# Altium schematic sheet Pixel1.0_2.SchDoc: Pixel1.0
size 409 x 282 mm; Date: 5/11/2016 6:59:09 PM; SheetNumber: 3
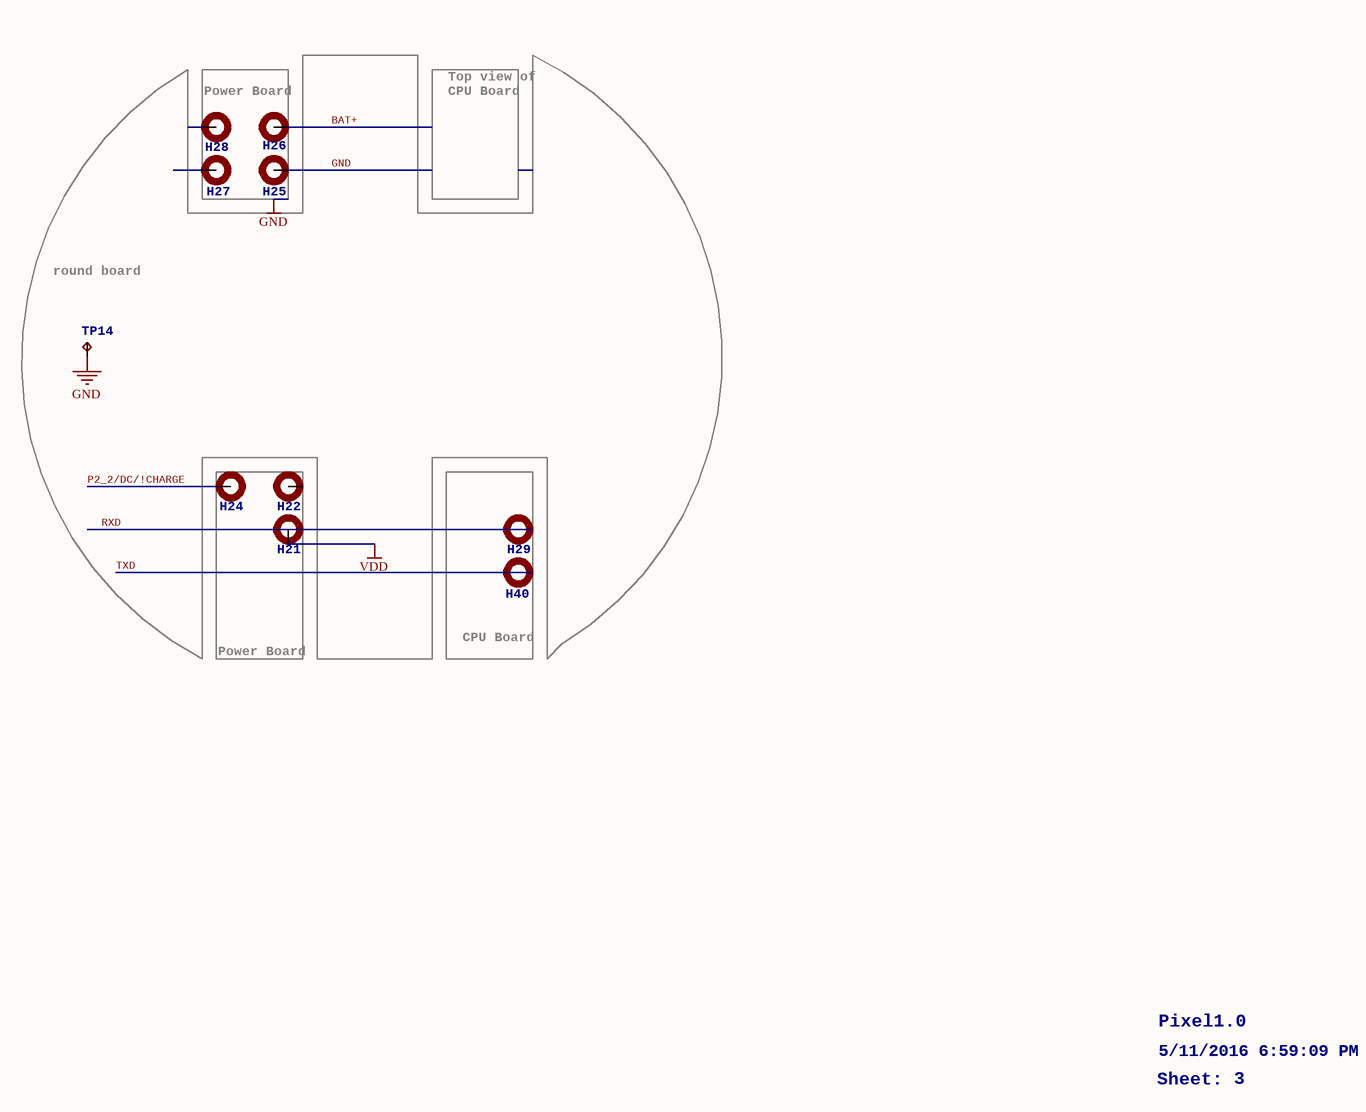
[diagram p0: Pixel1.0_2.SchDoc]

## Parts
H21  MOUNT-PAD-ROUNDTMOUNT1  [T-MOUNT1]  (value not drawn)
H22  MOUNT-PAD-ROUNDTMOUNT1  [T-MOUNT1]  (value not drawn)
H24  MOUNT-PAD-ROUNDTMOUNT1  [T-MOUNT1]  (value not drawn)
H25  MOUNT-PAD-ROUNDTMOUNT1  [T-MOUNT1]  (value not drawn)
H26  MOUNT-PAD-ROUNDTMOUNT1  [T-MOUNT1]  (value not drawn)
H27  MOUNT-PAD-ROUNDTMOUNT1  [T-MOUNT1]  (value not drawn)
H28  MOUNT-PAD-ROUNDTMOUNT1  [T-MOUNT1]  (value not drawn)
H29  MOUNT-PAD-ROUND1.5MMX1MM  [TMOUNT4]  (value not drawn)
H40  MOUNT-PAD-ROUND1.5MMX1MM  [TMOUNT4]  (value not drawn)
TP14  TPTP06R  [TP06R]  (value not drawn)

## Blocks framed on the sheet
Power Board: H25-H28
Power Board: H21 H22 H24
CPU Board: H29 H40

## Nets
GND: H25.1(MOUNT) TP14.TP
VDD: H21.1(MOUNT)
BAT+: H26.1(MOUNT)
P2_2/DC/!CHARGE: H24.1(MOUNT)
RXD: H29.1(MOUNT)
TXD: H40.1(MOUNT)

Not connected (* = marked no-connect by the designer): H22 1(MOUNT); H27 1(MOUNT); H28 1(MOUNT)

## Notes on the sheet
- Top view of
- CPU Board
- round board
- Pixel1.0
- 5/11/2016 6:59:09 PM
- Sheet:
- 3
- 1
- 2
- 4
- 5
- 6
- 7
- 8
- A
- B
- C
- D
- E

## Library data of the parts
H21 H22 H24-H28 = MOUNT-PAD-ROUNDTMOUNT1: MOUNTING PAD, round
H29 H40 = MOUNT-PAD-ROUND1.5MMX1MM: MOUNTING PAD, round
TP14 = TPTP06R: Test pad